# Altium project 0020-03_FFT2G.PrjPcb
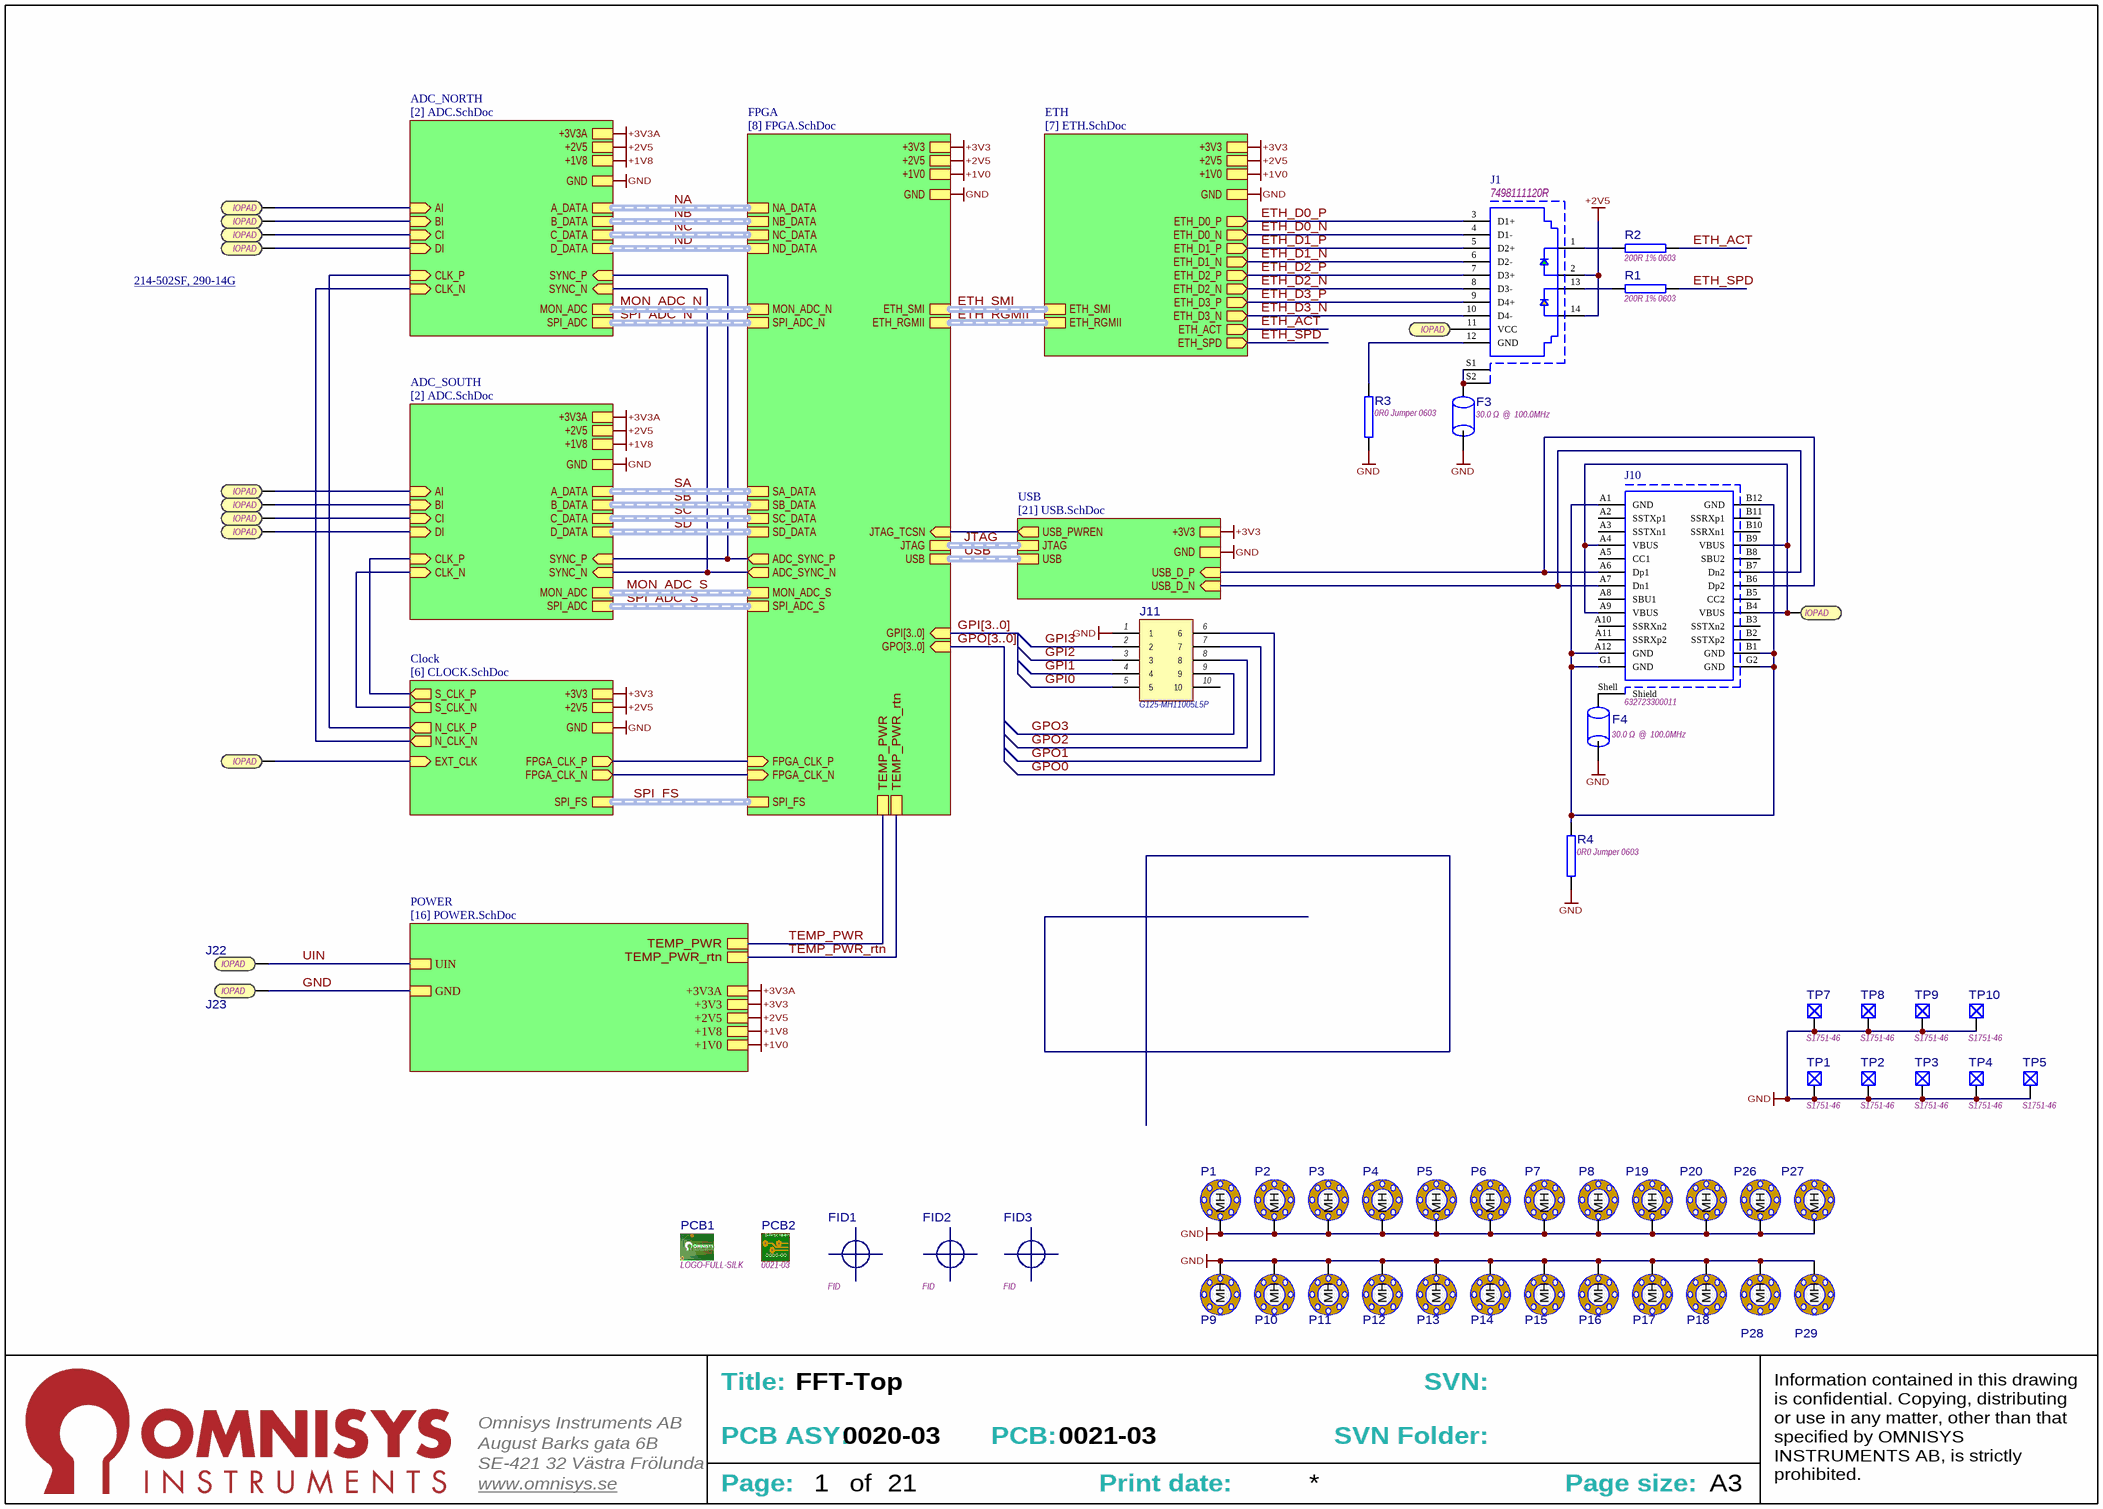
[diagram p0: [1] 0020-03_FFT2G - Top.SchDoc]
PCB_Part: 0021-03; PCBASY_Part: 0020-03
1 sheet, 60 parts. Net scope: strictly hierarchical (ports join the sheet entries above them; power ports are local).
Board file: 0020-03_FFT2G.PcbDoc

## Sheet [1] 0020-03_FFT2G - Top.SchDoc: FFT-Top
size 393 x 281 mm; Notes: No notes; Part_And_Rev: 0000-00; Drawing_Configuration: No Configuration; SheetNumber: 1; SheetTotal: 21; CompanyName: Omnisys Instruments AB; DrawnBy: Enter Name; PageSetup: Record=PageOptions|CenterHorizontal=True|CenterVertical=True|PrintScale=0.94|XCorrection=0.00|YCorrection=0.00|PrintKind=0|BorderSize=5000000|LeftOffset=0|BottomOffset=0|Orientation=2|PaperLength=1000|PaperWidth=1000|Scale=100|PaperSource=15|PrintQuality=-3|MediaType=1|DitherType=10|PrintScaleMode=1|PaperKind=10" x 14"|PaperIndex=16; Adr1: August Barks gata 6B; Adr2: SE-421 32 Västra Frölunda; Adr3: Sweden; Webpage: www.omnisys.se

### Parts
F3  30.0 Ω  @  100.0MHz  [INDC2012X11N]
F4  30.0 Ω  @  100.0MHz  [INDC2012X11N]
FID1  FID  [FID]
FID2  FID  [FID]
FID3  FID  [FID]
J1  7498111120R  [7498111120R-Footprint-1]
J2  IOPAD  [SMT_IO_PAD_0.5x0.5MM]  (no BOM)
J3  IOPAD  [SMT_IO_PAD_0.5x0.5MM]  (no BOM)
J4  IOPAD  [SMT_IO_PAD_0.5x0.5MM]  (no BOM)
J5  IOPAD  [SMT_IO_PAD_0.5x0.5MM]  (no BOM)
J6  IOPAD  [SMT_IO_PAD_0.5x0.5MM]  (no BOM)
J7  IOPAD  [SMT_IO_PAD_0.5x0.5MM]  (no BOM)
J8  IOPAD  [SMT_IO_PAD_0.5x0.5MM]  (no BOM)
J9  IOPAD  [SMT_IO_PAD_0.5x0.5MM]  (no BOM)
J10  632723300011  [632723300011]
J11  G125-MH11005L5P  [G125-MH11005L5P-Footprint-1]
J15  IOPAD  [SMT_IO_PAD_0.5x0.5MM]  (no BOM)
J17  IOPAD  [SMT_IO_PAD_2x1MM]  (no BOM)
J18  IOPAD  [SMT_IO_PAD_2x1MM]  (no BOM)
J22  IOPAD  [SMT_IO_PAD_4x2MM]  (no BOM)
J23  IOPAD  [SMT_IO_PAD_4x2MM]  (no BOM)
P1  M2.5-6.3mm pad  [MH6.3-2_7MM]  (value not drawn)  (no BOM)
P2  M2.5-6.3mm pad  [MH6.3-2_7MM]  (value not drawn)  (no BOM)
P3  M2.5-6.3mm pad  [MH6.3-2_7MM]  (value not drawn)  (no BOM)
P4  M2.5-6.3mm pad  [MH6.3-2_7MM]  (value not drawn)  (no BOM)
P5  M2.5-6.3mm pad  [MH6.3-2_7MM]  (value not drawn)  (no BOM)
P6  M2.5-6.3mm pad  [MH6.3-2_7MM]  (value not drawn)  (no BOM)
P7  M2.5-6.3mm pad  [MH6.3-2_7MM]  (value not drawn)  (no BOM)
P8  M2.5-6.3mm pad  [MH6.3-2_7MM]  (value not drawn)  (no BOM)
P9  M2.5-6.3mm pad  [MH6.3-2_7MM]  (value not drawn)  (no BOM)
P10  M2.5-6.3mm pad  [MH6.3-2_7MM]  (value not drawn)  (no BOM)
P11  M2.5-6.3mm pad  [MH6.3-2_7MM]  (value not drawn)  (no BOM)
P12  M2.5-6.3mm pad  [MH6.3-2_7MM]  (value not drawn)  (no BOM)
P13  M2.5-6.3mm pad  [MH6.3-2_7MM]  (value not drawn)  (no BOM)
P14  M2.5-6.3mm pad  [MH6.3-2_7MM]  (value not drawn)  (no BOM)
P15  M2.5-6.3mm pad  [MH6.3-2_7MM]  (value not drawn)  (no BOM)
P16  M2.5-6.3mm pad  [MH6.3-2_7MM]  (value not drawn)  (no BOM)
P17  M2.5-6.3mm pad  [MH6.3-2_7MM]  (value not drawn)  (no BOM)
P18  M2.5-6.3mm pad  [MH6.3-2_7MM]  (value not drawn)  (no BOM)
P19  M2.5-6.3mm pad  [MH6.3-2_7MM]  (value not drawn)  (no BOM)
P20  M2.5-6.3mm pad  [MH6.3-2_7MM]  (value not drawn)  (no BOM)
P26  M2.5-6.3mm pad  [MH6.3-2_7MM]  (value not drawn)  (no BOM)
P27  M2.5-6.3mm pad  [MH6.3-2_7MM]  (value not drawn)  (no BOM)
P28  M2.5-6.3mm pad  [MH6.3-2_7MM]  (value not drawn)  (no BOM)
P29  M2.5-6.3mm pad  [MH6.3-2_7MM]  (value not drawn)  (no BOM)
PCB1  LOGO-FULL-SILK  [LOGO-FULL-SILK]  (no BOM)
PCB2  0021-03  [PCBNo_SILK]
R1  200R 1% 0603  [RESC1608N]
R2  200R 1% 0603  [RESC1608N]
R3  0R0 Jumper 0603  [RESC1608N]
R4  0R0 Jumper 0603  [RESC1608N]
TP1  S1751-46  [S1751-46]
TP2  S1751-46  [S1751-46]
TP3  S1751-46  [S1751-46]
TP4  S1751-46  [S1751-46]
TP5  S1751-46  [S1751-46]
TP7  S1751-46  [S1751-46]
TP8  S1751-46  [S1751-46]
TP9  S1751-46  [S1751-46]
TP10  S1751-46  [S1751-46]

### Sub-sheets
ADC_NORTH = [2] ADC.SchDoc (file not in this document): SYNC_P (in), SYNC_N (in), CLK_P (in), CLK_N (in), A_DATA (harness ADC Port), B_DATA (harness ADC Port), C_DATA (harness ADC Port), D_DATA (harness ADC Port), DI (in), AI (in), BI (in), CI (in), SPI_ADC (harness SPI_ADC), +3V3A, GND, +1V8, MON_ADC (harness MON_ADC), +2V5
ADC_SOUTH = [2] ADC.SchDoc (file not in this document): SYNC_P (in), SYNC_N (in), CLK_P (in), CLK_N (in), A_DATA (harness ADC Port), B_DATA (harness ADC Port), C_DATA (harness ADC Port), D_DATA (harness ADC Port), DI (in), AI (in), BI (in), CI (in), SPI_ADC (harness SPI_ADC), +3V3A, GND, +1V8, MON_ADC (harness MON_ADC), +2V5
Clock = [6] CLOCK.SchDoc (file not in this document): EXT_CLK (in), N_CLK_P (out), N_CLK_N (out), S_CLK_P (out), S_CLK_N (out), +3V3, +2V5, GND, SPI_FS (harness SPI_FS), FPGA_CLK_P (out), FPGA_CLK_N (out)
ETH = [7] ETH.SchDoc (file not in this document): +2V5, +1V0, GND, +3V3, ETH_SMI (harness ETH_SMI), ETH_D3_P (out), ETH_D2_P (out), ETH_D2_N (out), ETH_D3_N (out), ETH_D0_N (out), ETH_RGMII (harness ETH_RGMII), ETH_D1_P (out), ETH_D0_P (out), ETH_D1_N (out), ETH_SPD (out), ETH_ACT (out)
FPGA = [8] FPGA.SchDoc (file not in this document): NA_DATA (harness ADC Port), NB_DATA (harness ADC Port), NC_DATA (harness ADC Port), SA_DATA (harness ADC Port), ND_DATA (harness ADC Port), SB_DATA (harness ADC Port), SC_DATA (harness ADC Port), SD_DATA (harness ADC Port), ADC_SYNC_P (out), ADC_SYNC_N (out), +1V0, GND, +2V5, +3V3, MON_ADC_S (harness MON_ADC), MON_ADC_N (harness MON_ADC), FPGA_CLK_N (in), FPGA_CLK_P (in), SPI_FS (harness SPI_FS), SPI_ADC_S (harness SPI_ADC), SPI_ADC_N (harness SPI_ADC), JTAG (harness USB JTAG), JTAG_TCSN (in), USB (harness USB FIFO), GPI[3..0] (in), ETH_SMI (harness ETH_SMI), ETH_RGMII (harness ETH_RGMII), GPO[3..0] (in), TEMP_PWR_rtn, TEMP_PWR
POWER = [16] POWER.SchDoc (file not in this document): +3V3A, +3V3, +2V5, +1V8, +1V0, UIN, GND, TEMP_PWR_rtn, TEMP_PWR
USB = [21] USB.SchDoc (file not in this document): USB_PWREN (out), USB_D_N (in), USB_D_P (in), JTAG (harness USB JTAG), USB (harness USB FIFO), +3V3, GND

### Nets
+1V0: sheet FPGA/+1V0, sheet ETH/+1V0, sheet POWER/+1V0
+1V8: sheet ADC_SOUTH/+1V8, sheet ADC_NORTH/+1V8, sheet POWER/+1V8
+2V5: J1.2 J1.14 ; sheet ADC_SOUTH/+2V5, sheet Clock/+2V5, sheet FPGA/+2V5, sheet ADC_NORTH/+2V5, sheet ETH/+2V5, sheet POWER/+2V5
+3V3: sheet Clock/+3V3, sheet USB/+3V3, sheet FPGA/+3V3, sheet ETH/+3V3, sheet POWER/+3V3
+3V3A: sheet ADC_SOUTH/+3V3A, sheet ADC_NORTH/+3V3A, sheet POWER/+3V3A
GND: F3.1 F4.1 J11.1 J23.1 P1.MH P2.MH P3.MH P4.MH P5.MH P6.MH P7.MH P8.MH P9.MH P10.MH P11.MH P12.MH P13.MH P14.MH P15.MH P16.MH P17.MH P18.MH P19.MH P20.MH P26.MH P27.MH P28.MH P29.MH R3.1 R4.1 TP1.1 TP2.1 TP3.1 TP4.1 TP5.1 TP7.1 TP8.1 TP9.1 TP10.1 ; sheet ADC_SOUTH/GND, sheet Clock/GND, sheet USB/GND, sheet FPGA/GND, sheet ADC_NORTH/GND, sheet ETH/GND, sheet POWER/GND
ETH_ACT: R2.2 ; sheet ETH/ETH_ACT
ETH_D0_N: J1.4(D1-) ; sheet ETH/ETH_D0_N
ETH_D0_P: J1.3(D1+) ; sheet ETH/ETH_D0_P
ETH_D1_N: J1.6(D2-) ; sheet ETH/ETH_D1_N
ETH_D1_P: J1.5(D2+) ; sheet ETH/ETH_D1_P
ETH_D2_N: J1.8(D3-) ; sheet ETH/ETH_D2_N
ETH_D2_P: J1.7(D3+) ; sheet ETH/ETH_D2_P
ETH_D3_N: J1.10(D4-) ; sheet ETH/ETH_D3_N
ETH_D3_P: J1.9(D4+) ; sheet ETH/ETH_D3_P
ETH_SPD: R1.2 ; sheet ETH/ETH_SPD
GPI0: J11.5
GPI1: J11.4
GPI2: J11.3
GPI3: J11.2
GPO0: J11.6
GPO1: J11.7
GPO2: J11.8
GPO3: J11.9
TEMP_PWR: sheet FPGA/TEMP_PWR, sheet POWER/TEMP_PWR
TEMP_PWR_rtn: sheet FPGA/TEMP_PWR_rtn, sheet POWER/TEMP_PWR_rtn
UIN: J22.1 ; sheet POWER/UIN
NetF3_2: F3.2 J1.S1(Shield) J1.S2(Shield)
NetF4_2: F4.2 J10.Shell(Shield)
NetJ1_1: J1.1 R2.1
NetJ1_11: J1.11(VCC) J17.1
NetJ1_12: J1.12(GND) R3.2
NetJ1_13: J1.13 R1.1
NetJ2_1: J2.1 ; sheet ADC_NORTH/AI
NetJ3_1: J3.1 ; sheet ADC_NORTH/BI
NetJ4_1: J4.1 ; sheet ADC_NORTH/CI
NetJ5_1: J5.1 ; sheet ADC_NORTH/DI
NetJ6_1: J6.1 ; sheet ADC_SOUTH/AI
NetJ7_1: J7.1 ; sheet ADC_SOUTH/BI
NetJ8_1: J8.1 ; sheet ADC_SOUTH/CI
NetJ9_1: J9.1 ; sheet ADC_SOUTH/DI
NetJ10_A1: J10.A1(GND) J10.A12(GND) J10.B1(GND) J10.B12(GND) J10.G1(GND) J10.G2(GND) R4.2
NetJ10_A4: J10.A4(VBUS) J10.A9(VBUS) J10.B4(VBUS) J10.B9(VBUS) J18.1
NetJ10_A6: J10.A6(Dp1) J10.B6(Dp2) ; sheet USB/USB_D_P
NetJ10_A7: J10.A7(Dn1) J10.B7(Dn2) ; sheet USB/USB_D_N
NetJ15_1: J15.1 ; sheet Clock/EXT_CLK
(unnamed): sheet ADC_SOUTH/SYNC_P, sheet FPGA/ADC_SYNC_P, sheet ADC_NORTH/SYNC_P
(unnamed): sheet ADC_SOUTH/SYNC_N, sheet FPGA/ADC_SYNC_N, sheet ADC_NORTH/SYNC_N
(unnamed): sheet ADC_SOUTH/CLK_P, sheet Clock/S_CLK_P
(unnamed): sheet ADC_SOUTH/CLK_N, sheet Clock/S_CLK_N
(unnamed): sheet Clock/N_CLK_P, sheet ADC_NORTH/CLK_P
(unnamed): sheet Clock/N_CLK_N, sheet ADC_NORTH/CLK_N
(unnamed): sheet Clock/FPGA_CLK_P, sheet FPGA/FPGA_CLK_P
(unnamed): sheet Clock/FPGA_CLK_N, sheet FPGA/FPGA_CLK_N
(unnamed): sheet USB/USB_PWREN, sheet FPGA/JTAG_TCSN

Not connected (* = marked no-connect by the designer): J10 A2(SSTXp1) A3(SSTXn1) A5(CC1) A8(SBU1) A10(SSRXn2) A11(SSRXp2) B2(SSTXp2) B3(SSTXn2) B5(CC2) B8(SBU2) B10(SSRXn1) B11(SSRXp1); J11 10

### Buses and harness runs
bus GPI[3..0] = sheet FPGA/GPI[3..0]
bus GPO[3..0] = sheet FPGA/GPO[3..0]
harness ETH_RGMII = sheet ETH/ETH_RGMII = sheet FPGA/ETH_RGMII
harness ETH_SMI = sheet ETH/ETH_SMI = sheet FPGA/ETH_SMI
harness JTAG = sheet FPGA/JTAG = sheet USB/JTAG
harness MON_ADC_N = sheet ADC_NORTH/MON_ADC = sheet FPGA/MON_ADC_N
harness MON_ADC_S = sheet ADC_SOUTH/MON_ADC = sheet FPGA/MON_ADC_S
harness NA = sheet ADC_NORTH/A_DATA = sheet FPGA/NA_DATA
harness NB = sheet ADC_NORTH/B_DATA = sheet FPGA/NB_DATA
harness NC = sheet ADC_NORTH/C_DATA = sheet FPGA/NC_DATA
harness ND = sheet ADC_NORTH/D_DATA = sheet FPGA/ND_DATA
harness SA = sheet ADC_SOUTH/A_DATA = sheet FPGA/SA_DATA
harness SB = sheet ADC_SOUTH/B_DATA = sheet FPGA/SB_DATA
harness SC = sheet ADC_SOUTH/C_DATA = sheet FPGA/SC_DATA
harness SD = sheet ADC_SOUTH/D_DATA = sheet FPGA/SD_DATA
harness SPI_ADC_N = sheet ADC_NORTH/SPI_ADC = sheet FPGA/SPI_ADC_N
harness SPI_ADC_S = sheet ADC_SOUTH/SPI_ADC = sheet FPGA/SPI_ADC_S
harness SPI_FS = sheet Clock/SPI_FS = sheet FPGA/SPI_FS
harness USB = sheet FPGA/USB = sheet USB/USB

### Notes on the sheet
- 214-502SF, 290-14G <https://mpd.southwestmicrowave.com/product/214-502sf-supersma-jack-female-2-hole-625-long/>
- Title:
- SVN:
- August Barks gata 6B
- SE-421 32 Västra Frölunda
- Omnisys Instruments AB
- PCB ASY:
- PCB:
- SVN Folder:
- www.omnisys.se
- Page:
- of
- Print date:
- Page size:
- A3
- Information contained in this drawing is confidential. Copying, distributing or use in any matter, other than that specified by OMNISYS INSTRUMENTS AB, is strictly prohibited.
- (in symbol CMP-4700-000000-3) Silkscreen; 0000-00

### Library data of the parts
F3 F4 = CMP-0600-000010-2: Ferrite bead, Würth Elektronik WE-CBF 2012 (0805), 74279206 ,  30.0 Ω  @  100.0MHz; Zmax@Freq: 55.0 Ω  @      1.0 GHz; Type: High Current; RDC: 25.0 mΩ; IDC: 3.0 A; Z@Freq: 30.0 Ω  @  100.0MHz; PartNumber: 74279206
FID1-FID3 = CMP-1600-000001-2: Pick and place fiducial
J1 = CMP-1000-000522-2: CONN MAGJACK 1PORT 1000 BASE-T; PartNumber: 7498111120AR; Pitch: 2.54mm; Gender: Female; Number of Positions: 8; Shielding: Shielded; Direction: Up; Number of Ports: 1; Connector Type: RJ45; Mount: Surface Mount,Edge; Color: Green,Yellow,Black; Contact Plating: Gold; Housing Material: Polymer; Package Quantity: 100; Max Operating Temperature: 70°C; Number of Rows: 1; Termination: SMD/SMT; Packaging: Tape and Reel; Mounting type: SMD; Lead Free: Lead Free; Number of Cores per Jack: 8; Min Operating Temperature: 0°C; REACH SVHC: Unknown; Number of Contacts: 8; Rows: 1; Pins: 14; Contact Material: Bronze
J2-J9 J15 = CMP-1000-000525-1: Square IO pad 0.5x0.5mm used for test points and flying leads.
J10 = CMP-1502-03214-1: USB 3.1 Type C Receptacle WR-COM, Horizontal, SMT / THT; Manufacturer: Wurth Elektronik; Rated Current: 5A; Contact Resistance: 30mOhm; Working Voltage: 20VDC; Operating Temperature: -40to105degC; Package Reference: 632723300011; Datasheet URL: https://katalog.we-online.de/em/datasheet/632723x00011%282%29.pdf; Manufacturer URL: http://www.we-online.de; Connector Type: USB3.1TypeC; Gender: Receptacle; Part Number: 632723300011; Mounting Technology: SMT/THT; Publisher: WurthElektronik; Packaging: TapeandReel; Orientation: Horizontal
J11 = CMP-1000-000523-2: CONN HDR 1.25MM R/A PCB 10POS; Row Spacing: 0.049inch; Number of Positions: 10; Rows: 2; Connector Type: Male Pin; Contact Plating: Gold; Number of Rows: 2; Number of Pins: 10; Mount: Through Hole; Color: Green; Termination: Solder; Pins: 10; Pitch: 0.049inch; Packaging: Cut Strip
J17 J18 J22 J23 = CMP-1000-000152-5: IO pad used for test points and flying leads.
P1-P20 P26-P29 = CMP-1600-000026-1: Mounting hole, M2.5-6.3mm pad
PCB1 = CMP-4700-000008-1: Full logo in Silkscreen
PCB2 = CMP-4700-000000-3: PCB part number, silkscreen layer
R1 R2 = CMP-1800-002005-5: Thick film Chip Resistor, 0603/1608; Value: 200; Power: 100mW; Maximum working voltage: 75V; Temp. Coefficent: 0.01%; Tolerance: 1%; Case/Package: 0603/1608; Composition: Thick film
R3 R4 = CMP-1800-001949-5: Thick film Chip Resistor, 0603/1608; Value: 0; Tolerance: 0%; Power: 0W; Maximum working voltage: 75V; Temp. Coefficent: 0%; Case/Package: 0603/1608; Composition: Thick film
TP1-TP5 TP7-TP10 = CMP-3600-000004-2: SMD Test point clip; PartNumber: S1751-46

## Assembly variants
Design Variant: not fitted C72 C73 C74 C75 C76 C77 C78 C79 C80 C81 C82 C83 F3 F12 F13 J1 J2 J3 J4 J5 J6 J7 J8 J9 J12.1 J12.2 J12.3 J12.4 J13.1 J13.2 J13.3 J13.4 J14.1 J14.2 J14.3 J14.4 J15 J16.1 J16.2 J16.3 J16.4 J17 J18 J19 J20.1 J20.2 J20.3 J20.4 J21.1 J21.2 J21.3 J21.4 J22 J23 P1 P2 P3 P4 P5 P6 P7 P8 P9 P10 P11 P12 P13 P14 P15 P16 P17 P18 P19 P20 P21 P22 P23 P24 P25 P26 P27 P28 P29 PCB1 PCB2 R1 R2 R3 R31 R35 R38 R49 R50 R51 R52 R53 R54 R55 R56 R57 R84 R85 R86 R87 R88 R89 R90 R91 R130.1 R130.2 R130.3 R130.4 R131.1 R131.2 R131.3 R131.4 R138 R139 U13 X3; alternate parts C200.2 -> CMP-0300-002446-6, C201.2 -> CMP-0300-002453-6, R132.2 -> CMP-1800-002039-5, R132.1 -> CMP-1800-002412-4, C200.3 -> CMP-0300-002446-6, C201.3 -> CMP-0300-002453-6, R132.3 -> CMP-1800-002042-5, C200.4 -> CMP-0300-002445-6, C201.4 -> CMP-0300-002450-6, R132.4 -> CMP-1800-002047-5, C200.1 -> CMP-0300-002447-6, C201.1 -> CMP-0300-002454-6, R48.2 -> CMP-1800-002464-4, R48.3 -> CMP-1800-002469-4, R48.4 -> CMP-1800-002442-4, C199.4 -> CMP-0300-002107-6